# EasyEDA schematic 1.json
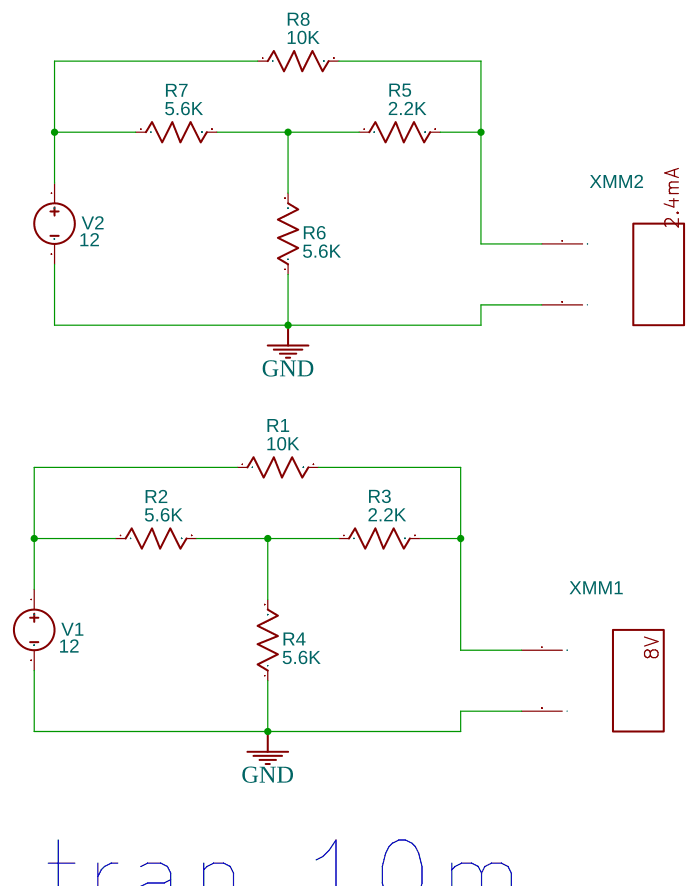
[diagram p0: schematic sheet]

## Parts
R1  10K  [AXIAL-0.3]
R2  5.6K  [AXIAL-0.3]
R3  2.2K  [AXIAL-0.3]
R4  5.6K  [AXIAL-0.3]
R5  2.2K  [AXIAL-0.3]
R6  5.6K  [AXIAL-0.3]
R7  5.6K  [AXIAL-0.3]
R8  10K  [AXIAL-0.3]
V1  12  [HDR1X2]
V2  12  [HDR1X2]
XMM1  Multimeter
XMM2  Multimeter

## Library data of the parts
R1-R8 = Resistor_US: Resistance: 1k; Contributor: EasyEDA; Supplier: YUJING
V1 V2 = VDC: Contributor: EasyEDA; sim: true
XMM1 = MULTIMETER: Supplier: LCSC; Multimeter Type: Voltmeter; Power Type: AC; Voltmeter resistance: 10μ; Ammeter resistance: 1G; NameDisplay: 0; Contributor: EasyEDA; sim: true
XMM2 = MULTIMETER: Supplier: LCSC; Multimeter Type: Amper; Power Type: AC; Voltmeter resistance: 10μ; Ammeter resistance: 1G; NameDisplay: 0; Contributor: EasyEDA; sim: true

## Nets
GND: R4.1 R6.1 V1.2 V2.2 XMM1.2(I) XMM2.2(I)
Net-(R1-1): R1.1 R2.1 V1.1
Net-(R1-2): R1.2 R3.2 XMM1.1(+)
Net-(R2-2): R2.2 R3.1 R4.2
Net-(R5-1): R5.1 R6.2 R7.2
Net-(R5-2): R5.2 R8.2 XMM2.1(+)
Net-(R7-1): R7.1 R8.1 V2.1

## Notes on the sheet
- .tran 10m
